# EAGLE schematic PRoMo_v0.1 (EAGLE 7.3.0)

## Sheet 1 of 3: dsPIC Stage
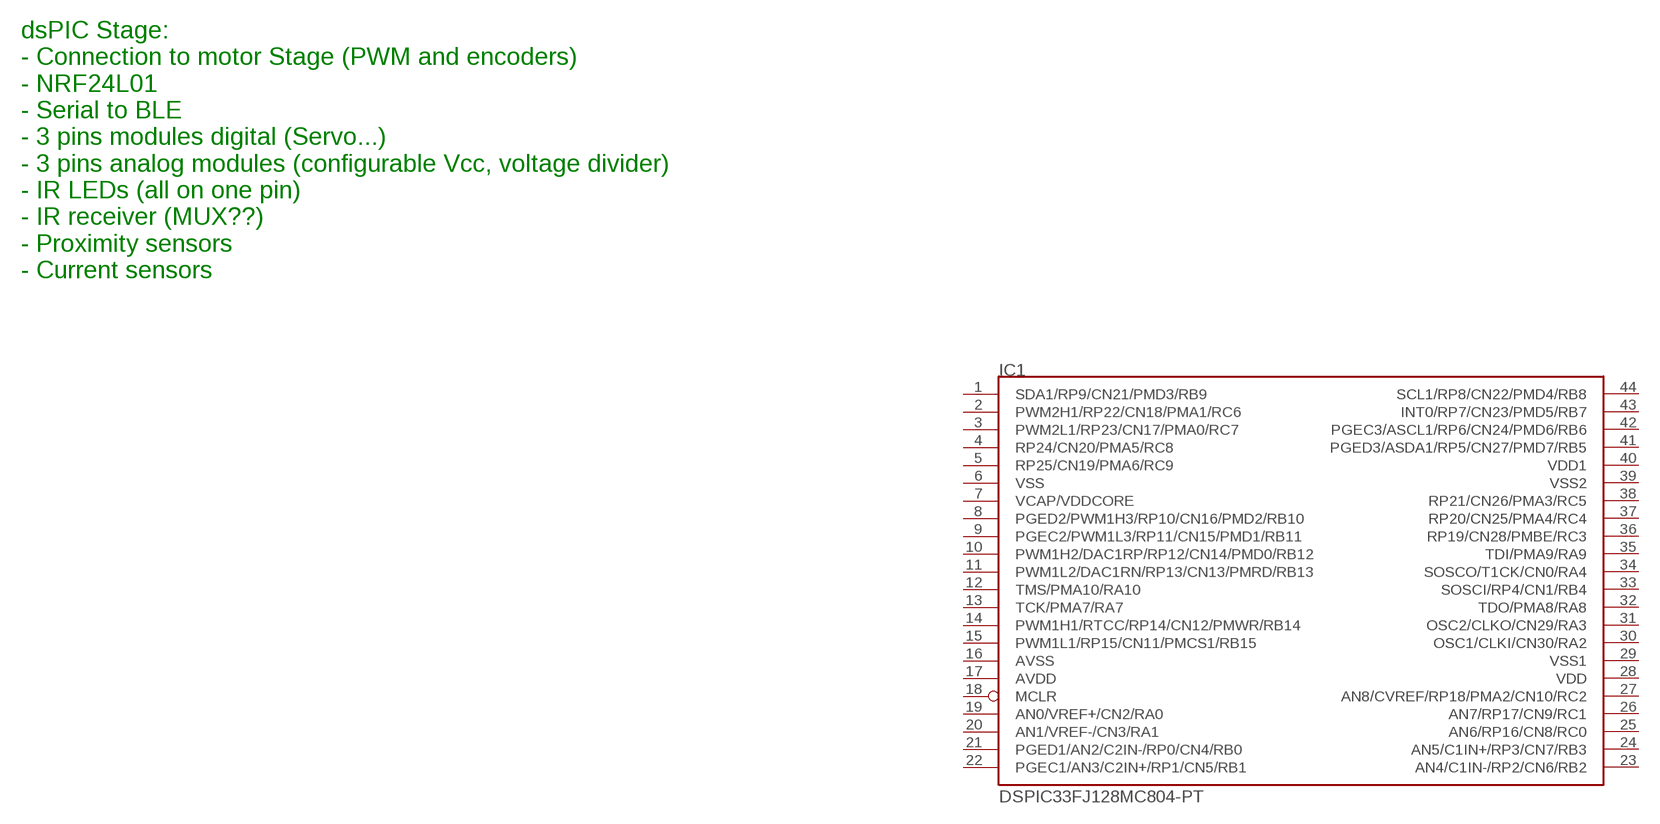
[diagram p0: schematic, sheet 1]

### Parts
IC1  DSPIC33FJ128MC804-PT  [TQFP44]
Unconnected: IC1.1(SDA1/RP9/CN21/PMD3/RB9) IC1.2(PWM2H1/RP22/CN18/PMA1/RC6) IC1.3(PWM2L1/RP23/CN17/PMA0/RC7) IC1.4(RP24/CN20/PMA5/RC8) IC1.5(RP25/CN19/PMA6/RC9) IC1.7(VCAP/VDDCORE) IC1.8(PGED2/PWM1H3/RP10/CN16/PMD2/RB10) IC1.9(PGEC2/PWM1L3/RP11/CN15/PMD1/RB11) IC1.10(PWM1H2/DAC1RP/RP12/CN14/PMD0/RB12) IC1.11(PWM1L2/DAC1RN/RP13/CN13/PMRD/RB13) IC1.12(TMS/PMA10/RA10) IC1.13(TCK/PMA7/RA7) IC1.14(PWM1H1/RTCC/RP14/CN12/PMWR/RB14) IC1.15(PWM1L1/RP15/CN11/PMCS1/RB15) IC1.18(MCLR) IC1.19(AN0/VREF+/CN2/RA0) IC1.20(AN1/VREF-/CN3/RA1) IC1.21(PGED1/AN2/C2IN-/RP0/CN4/RB0) IC1.22(PGEC1/AN3/C2IN+/RP1/CN5/RB1) IC1.23(AN4/C1IN-/RP2/CN6/RB2) IC1.24(AN5/C1IN+/RP3/CN7/RB3) IC1.25(AN6/RP16/CN8/RC0) IC1.26(AN7/RP17/CN9/RC1) IC1.27(AN8/CVREF/RP18/PMA2/CN10/RC2) IC1.30(OSC1/CLKI/CN30/RA2) IC1.31(OSC2/CLKO/CN29/RA3) IC1.32(TDO/PMA8/RA8) IC1.33(SOSCI/RP4/CN1/RB4) IC1.34(SOSCO/T1CK/CN0/RA4) IC1.35(TDI/PMA9/RA9) IC1.36(RP19/CN28/PMBE/RC3) IC1.37(RP20/CN25/PMA4/RC4) IC1.38(RP21/CN26/PMA3/RC5) IC1.41(PGED3/ASDA1/RP5/CN27/PMD7/RB5) IC1.42(PGEC3/ASCL1/RP6/CN24/PMD6/RB6) IC1.43(INT0/RP7/CN23/PMD5/RB7) IC1.44(SCL1/RP8/CN22/PMD4/RB8)

### Notes on the sheet
- dsPIC Stage:
  - Connection to motor Stage (PWM and encoders)
  - NRF24L01
  - Serial to BLE
  - 3 pins modules digital (Servo...)
  - 3 pins analog modules (configurable Vcc, voltage divider)
  - IR LEDs (all on one pin)
  - IR receiver (MUX??)
  - Proximity sensors
  - Current sensors

## Sheet 2 of 3: Motor Stage
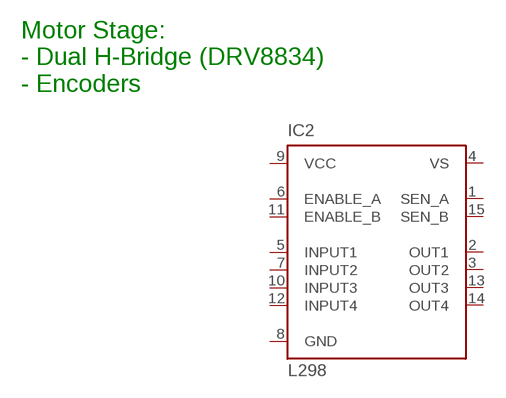
[diagram p1: schematic, sheet 2]

### Parts
IC2  L298  [MULTIWATT-15]
Unconnected: IC2.1(SEN_A) IC2.2(OUT1) IC2.3(OUT2) IC2.5(INPUT1) IC2.6(ENABLE_A) IC2.7(INPUT2) IC2.10(INPUT3) IC2.11(ENABLE_B) IC2.12(INPUT4) IC2.13(OUT3) IC2.14(OUT4) IC2.15(SEN_B)

### Notes on the sheet
- Motor Stage:
  - Dual H-Bridge (DRV8834)
  - Encoders

## Sheet 3 of 3: Power Stage
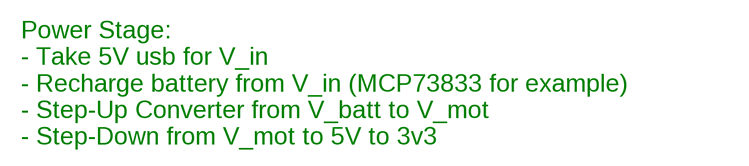
[diagram p2: schematic, sheet 3]

### Notes on the sheet
- Power Stage:
  - Take 5V usb for V_in
  - Recharge battery from V_in (MCP73833 for example)
  - Step-Up Converter from V_batt to V_mot
  - Step-Down from V_mot to 5V to 3v3

## Power pins joined to a net without a drawn wire
AVDD: IC1.17(AVDD)
AVSS: IC1.16(AVSS)
GND: IC2.8(GND)
VCC: IC2.9(VCC)
VDD: IC1.28(VDD)
VDD1: IC1.40(VDD1)
VS: IC2.4(VS)
VSS: IC1.6(VSS)
VSS1: IC1.29(VSS1)
VSS2: IC1.39(VSS2)

## Library data of the parts
IC1 = microchip-dspic33fjxxmc:DSPIC33FJ128MC804: dsPIC33FJ32MC302/304, dsPIC33FJ64MCX02/X04, AND dsPIC33FJ128MCX02/X04 High-Performance, 16-bit Digital Signal Controllers Package:44 Pin TQFP Operating Range: * Up to 40 MIPS operation (at 3.0V -3.6V): - Industrial temperature range (-40°C to +85°C) - Extended temperature range (-40°C to +125°C) High-Performance DSC CPU: * Modified Harvard architecture * C compiler optimized instruction set * 16-bit wide data path * 24-bit wide instructions * Linear program memory addressing up to 4M instruction words * Linear data memory addressing up to 64 Kbytes * 83 base instructions: mostly 1 word/1 cycle * Two 40-bit accumulators with rounding and saturation options * Flexible and powerful addressing modes: - Indirect - Modulo - Bit-Reversed * Software stack * 16 x 16 fractional/integer multiply operations * 32/16 and 16/16 divide operations * Single-cycle multiply and accumulate: - Accumulator write back for DSP operations - Dual data fetch * Up to ±16-bit shifts for up to 40-bit data Direct Memory Access (DMA): * 8-channel hardware DMA * Up to 2 Kbytes dual ported DMA buffer area (DMA RAM) to store data transferred via DMA: - Allows data transfer between RAM and a peripheral while CPU is executing code (no cycle stealing) * Most peripherals support DMA Timers/Capture/Compare/PWM: * Timer/Counters, up to five 16-bit timers: - Can pair up to make two 32-bit timers - One timer runs as a Real-Time Clock with an external 32.768 kHz oscillator - Programmable prescaler * Input Capture (up to four channels): - Capture on up, down or both edges - 16-bit capture input functions - 4-deep FIFO on each capture * Output Compare (up to four channels): - Single or Dual 16-bit Compare mode - 16-bit Glitchless PWM mode * Hardware Real-Time Clock/Calendar (RTCC): - Provides clock, calendar, and alarm functions Interrupt Controller: * 5-cycle latency * Up to 53 available interrupt sources * Up to three external interrupts * Seven programmable priority levels * Five processor exceptions Digital I/O: * Peripheral pin Select functionality * Up to 35 programmable digital I/O pins * Wake-up/Interrupt-on-Change for up to 31 pins * Output pins can drive from 3.0V to 3.6V * Up to 5V output with open drain configuration * All digital input pins are 5V tolerant * 4 mA sink on all I/O pins On-Chip Flash and SRAM: * Flash program memory (up to 128 Kbytes) * Data SRAM (up to 16 Kbytes) * Boot, Secure, and General Security for program Flash System Management: * Flexible clock options: - External, crystal, resonator, internal RC - Fully integrated Phase-Locked Loop (PLL) - Extremely low jitter PLL * Power-up Timer * Oscillator Start-up Timer/Stabilizer * Watchdog Timer with its own RC oscillator * Fail-Safe Clock Monitor * Reset by multiple sources Power Management: * On-chip 2.5V voltage regulator * Switch between clock sources in real time * Idle, Sleep, and Doze modes with fast wake-up Analog-to-Digital Converters (ADCs): * 10-bit, 1.1 Msps or 12-bit, 500 Ksps conversion: - Two and four simultaneous samples (10-bit ADC) - Up to nine input channels with auto-scanning - Conversion start can be manual or synchronized with one of four trigger sources - Conversion possible in Sleep mode - ±2 LSb max integral nonlinearity - ±1 LSb max differential nonlinearity Audio Digital-to-Analog Converter (DAC): - 16-bit Dual Channel DAC module - 100 Ksps maximum sampling rate - Second-Order Digital Delta-Sigma Modulator Comparator Module: * Two analog comparators with programmable input/output configuration CMOS Flash Technology: * Low-power, high-speed Flash technology * Fully static design * 3.3V (±10%) operating voltage * Industrial and Extended temperature * Low power consumption Motor Control Peripherals: * 6-channel 16-bit Motor Control PWM: - Three duty cycle generators - Independent or Complementary mode - Programmable dead-time and output polarity - Edge-aligned or center-aligned - Manual output override control - One Fault input - Trigger for ADC conversions - PWM frequency for 16-bit resolution (@ 40 MIPS) = 1220 Hz for Edge-Aligned mode, 610 Hz for Center-Aligned mode - PWM frequency for 11-bit resolution (@ 40 MIPS) = 39.1 kHz for Edge-Aligned mode, 19.55 kHz for Center-Aligned mode * 2-channel 16-bit Motor Control PWM: - One duty cycle generator - Independent or Complementary mode - Programmable dead time and output polarity - Edge-aligned or center-aligned - Manual output override control - One Fault input - Trigger for ADC conversions - PWM frequency for 16-bit resolution (@ 40 MIPS) = 1220 Hz for Edge-Aligned mode, 610 Hz for Center-Aligned mode - PWM frequency for 11-bit resolution (@ 40 MIPS) = 39.1 kHz for Edge-Aligned mode, 19.55 kHz for Center-Aligned mode * 2-Quadrature Encoder Interface module: - Phase A, Phase B, and index pulse input - 16-bit up/down position counter - Count direction status - Position Measurement (x2 and x4) mode - Programmable digital noise filters on inputs - Alternate 16-bit Timer/Counter mode - Interrupt on position counter rollover/underflow
IC2 = st-microelectronics:L298: DUAL FULL-BRIDGE DRIVER; MPN: L298N; OC_FARNELL: 1589425; OC_NEWARK: 32M1527